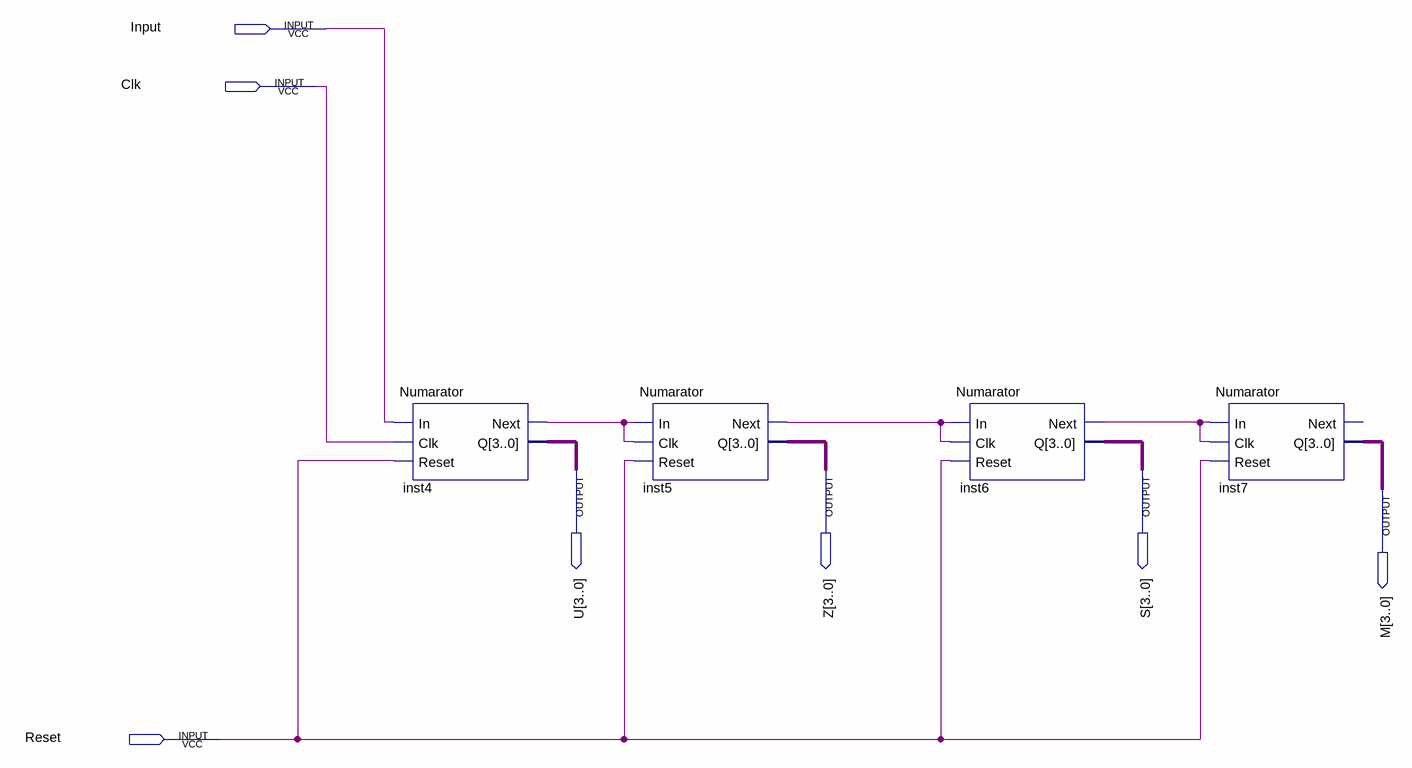
[diagram p0: schematic sheet]
// Quartus schematic Bloc_Numarare.bdf as structural Verilog: 4 symbols, 7 pins
module Bloc_Numarare (
  input  Input,
  input  Clk,
  input  Reset,
  output [3:0] U,
  output [3:0] Z,
  output [3:0] S,
  output [3:0] M
);

  wire inst4_next, inst5_next, inst6_next;

  Numarator inst4 (.In(Input), .Clk(Clk), .Reset(Reset), .Next(inst4_next), .Q(U));
  Numarator inst5 (.In(inst4_next), .Clk(inst4_next), .Reset(Reset), .Next(inst5_next), .Q(Z));
  Numarator inst6 (.In(inst5_next), .Clk(inst5_next), .Reset(Reset), .Next(inst6_next), .Q(S));
  Numarator inst7 (.In(inst6_next), .Clk(inst6_next), .Reset(Reset), .Q(M));  // open: Next
endmodule
